# EasyEDA schematic SCHEasyEda.json
TITLE: Sheet_1; REV: 1.0; Date: 2024-06-20; Sheet: 1/1; Drawn By: paologgalang; Company: Your Company
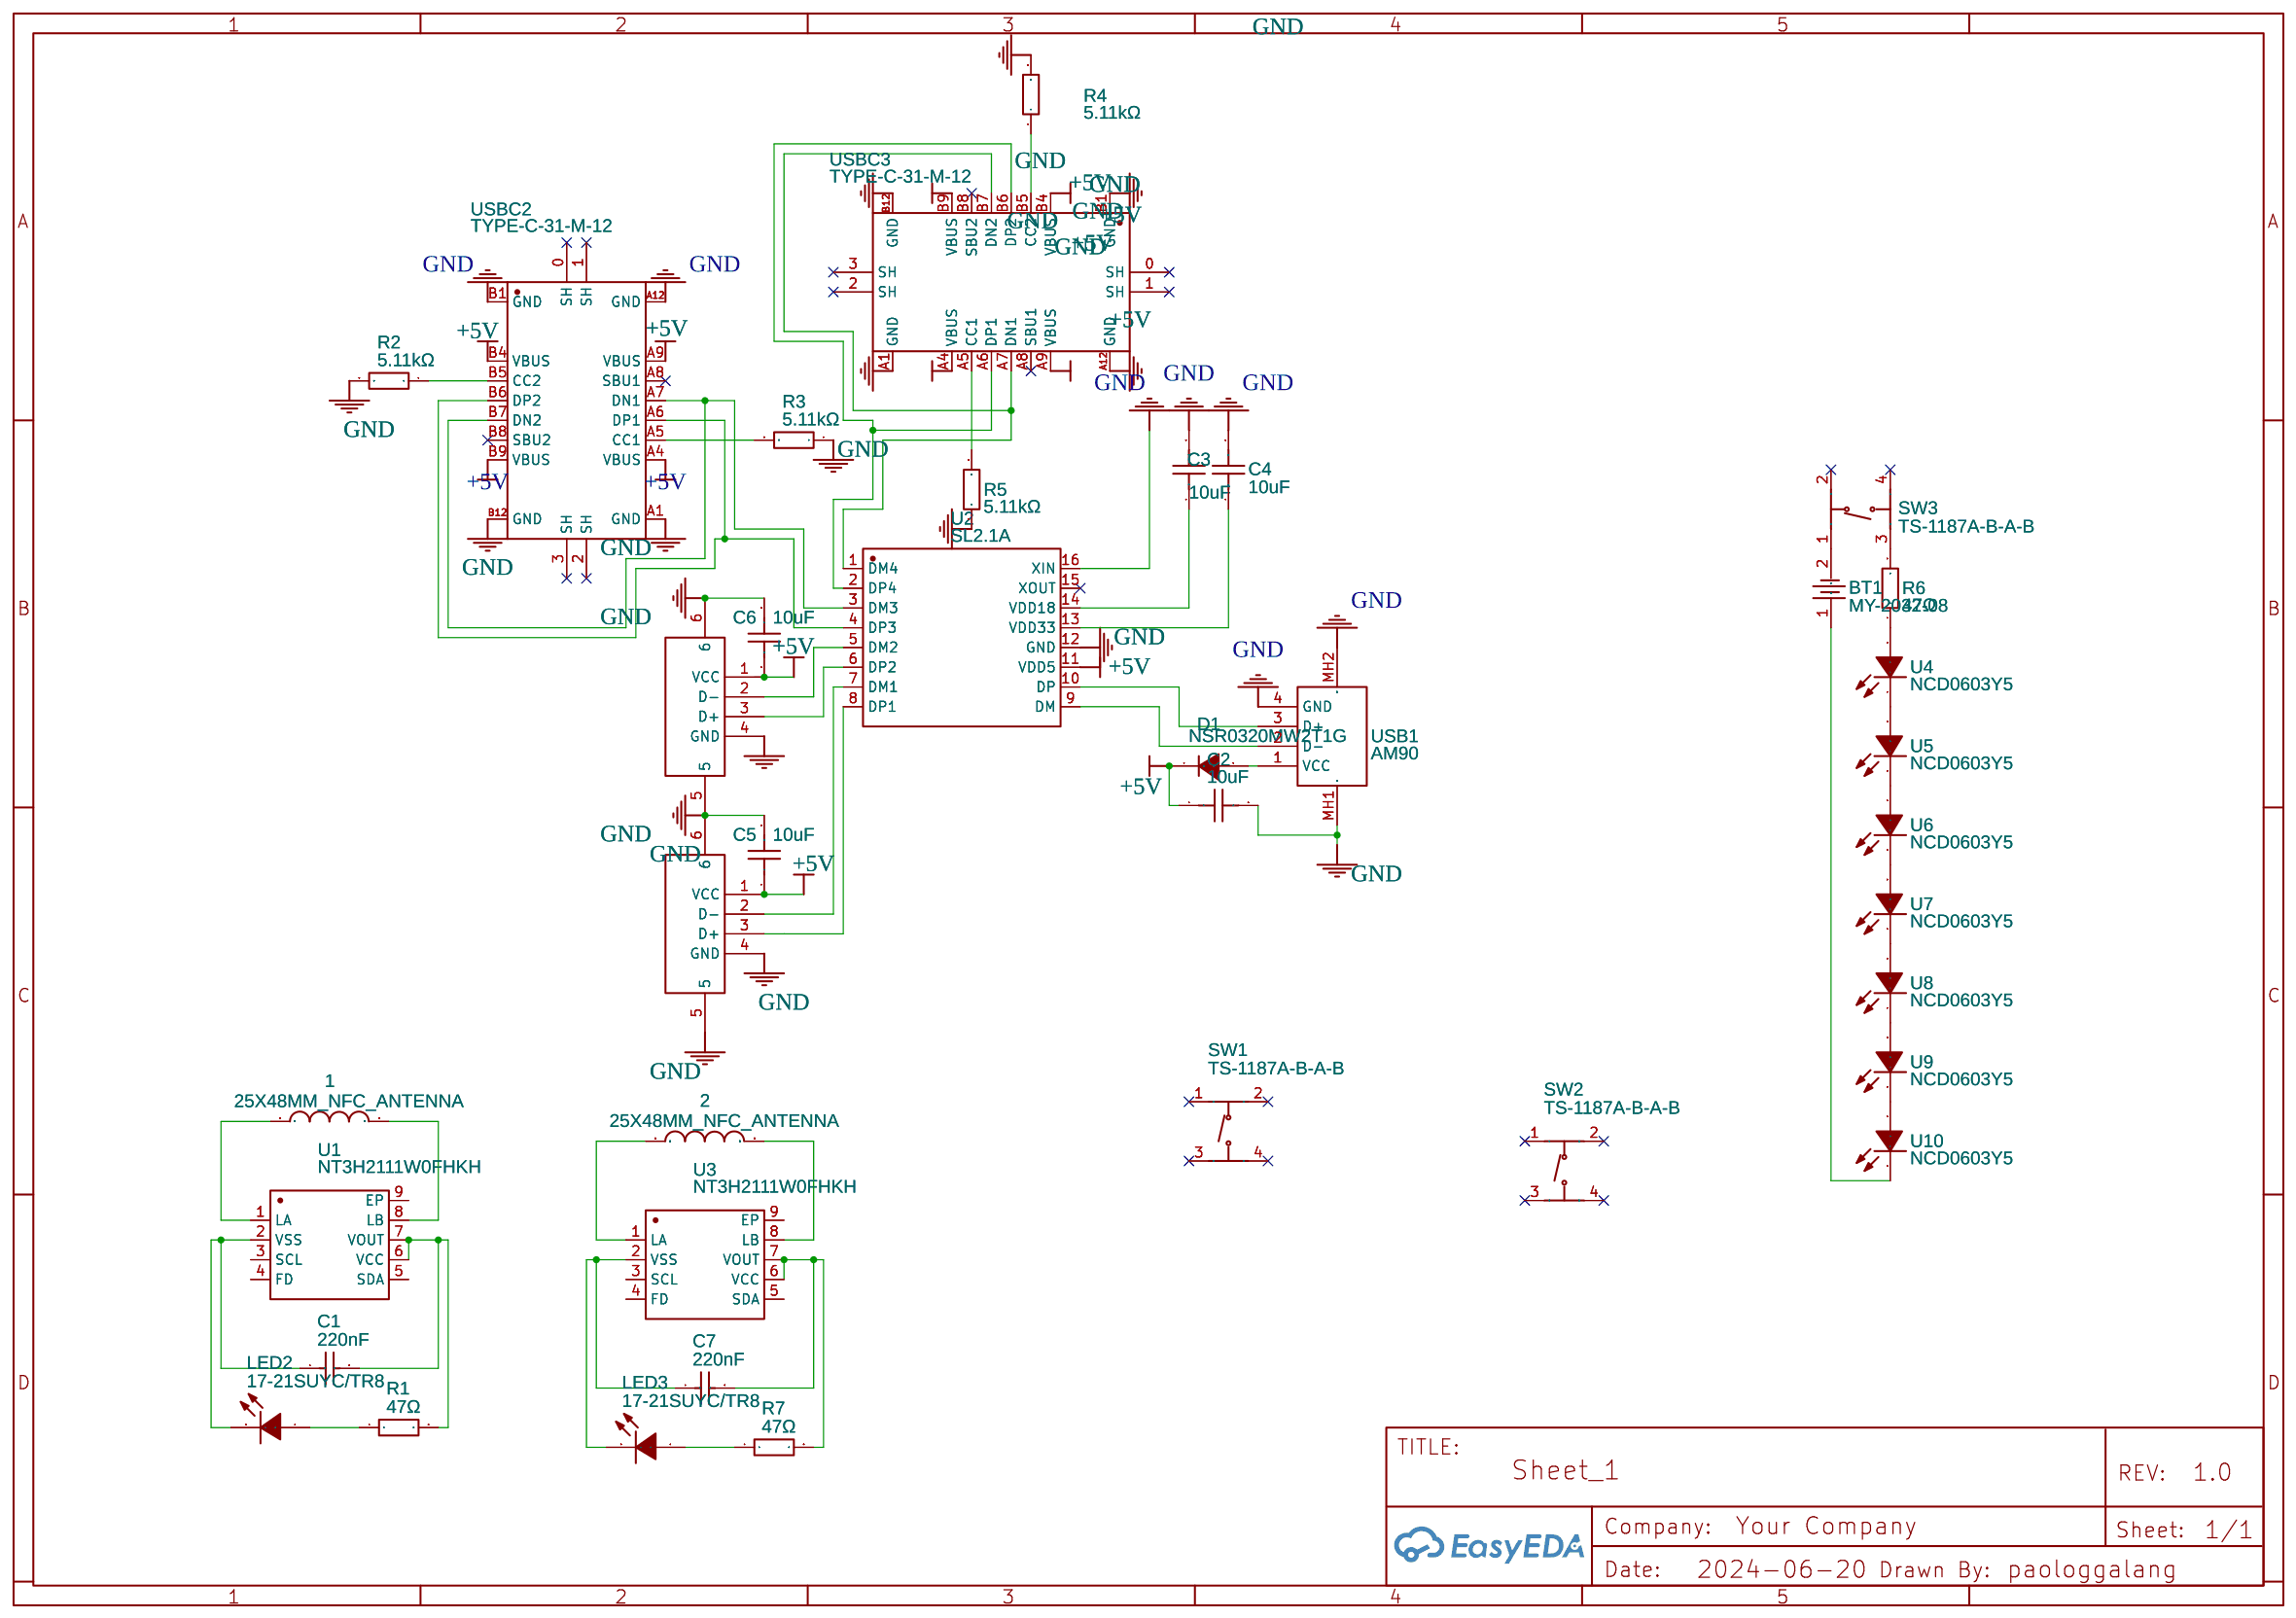
[diagram p0: schematic sheet]

## Parts
1  25X48MM_NFC_ANTENNA  [25X48MM_NFC_ANTENNA]
2  25X48MM_NFC_ANTENNA  [25X48MM_NFC_ANTENNA]
BT1  MY-2032-08  [BAT-SMD_MY-2032-08]
C1  220nF  [C0603]
C2  10uF  [C0603]
C3  10uF  [C0603]
C4  10uF  [C0603]
C5  10uF  [C0603]
C6  10uF  [C0603]
C7  220nF  [C0603]
D1  NSR0320MW2T1G  [SOD-323_L1.8-W1.3-LS2.5-RD]
LED2  17-21SUYC/TR8  [LED0805-R-RD]
LED3  17-21SUYC/TR8  [LED0805-R-RD]
R1  47Ω  [R0603]
R2  5.11kΩ  [R1206]
R3  5.11kΩ  [R1206]
R4  5.11kΩ  [R1206]
R5  5.11kΩ  [R1206]
R6  47Ω  [R0603]
R7  47Ω  [R0603]
SW1  TS-1187A-B-A-B  [SW-SMD_4P-L5.1-W5.1-P3.70-LS6.5-TL-2]
SW2  TS-1187A-B-A-B  [SW-SMD_4P-L5.1-W5.1-P3.70-LS6.5-TL-2]
SW3  TS-1187A-B-A-B  [SW-SMD_4P-L5.1-W5.1-P3.70-LS6.5-TL-2]
U1  NT3H2111W0FHKH  [XQFN-8_L1.6-W1.6-P0.50-BL]
U2  SL2.1A  [SOP-16_L10.0-W3.9-P1.27-LS6.0-BL]
U3  NT3H2111W0FHKH  [XQFN-8_L1.6-W1.6-P0.50-BL]
U4  NCD0603Y5  [LED0603-RD]
U5  NCD0603Y5  [LED0603-RD]
U6  NCD0603Y5  [LED0603-RD]
U7  NCD0603Y5  [LED0603-RD]
U8  NCD0603Y5  [LED0603-RD]
U9  NCD0603Y5  [LED0603-RD]
U10  NCD0603Y5  [LED0603-RD]
USB1  AM90  [USB-AM-TH_AM90]
USB2  USB-AF-90-14.4X13.6-H7.0-DIP  [USB-A-TH_C46407]
USB6  USB-AF-90-14.4X13.6-H7.0-DIP  [USB-A-TH_C46407]
USBC2  TYPE-C-31-M-12  [USB-C_SMD-TYPE-C-31-M-12]
USBC3  TYPE-C-31-M-12  [USB-C_SMD-TYPE-C-31-M-12]

## Library data of the parts
1 2 = 25X48MM_NFC_ANTENNA: Contributor: Спас Христов
BT1 = MY-2032-08: Contributor: LCSC; Supplier: LCSC; Supplier Part: C964831; Manufacturer: MYOUNG(美阳); JLCPCB Part Class: Extended Part
C1 C7 = CL10B224KA8NNNC: Supplier: LCSC; Manufacturer: SAMSUNG(三星); Supplier Part: C21120; JLCPCB Part Class: Basic Part
C2-C6 = CL10A106KP8NNNC: Supplier: LCSC; Manufacturer: SAMSUNG(三星); Supplier Part: C19702; JLCPCB Part Class: Basic Part
D1 = NSR0320MW2T1G: Supplier: LCSC; Manufacturer: onsemi(安森美); Supplier Part: C48192; JLCPCB Part Class: Extended Part
LED2 LED3 = 17-21SUYC/TR8: Supplier: LCSC; Manufacturer: KENTO; Manufacturer Part: KT-0805黄灯; Supplier Part: C2296; JLCPCB Part Class: Basic Part
R1 R6 R7 = 0603WAF470JT5E: Supplier: LCSC; Manufacturer: UNI-ROYAL(厚声); Supplier Part: C23182; JLCPCB Part Class: Basic Part
R2-R5 = RMC12065.11K1%N: Contributor: LCSC; Supplier: LCSC; Supplier Part: C269628; Manufacturer: Tyohm(幸亚电阻); JLCPCB Part Class: Extended Part
SW1-SW3 = TS-1187A-B-A-B: Contributor: LCSC; Supplier: LCSC; Supplier Part: C318884; Manufacturer: XKB Connectivity(中国星坤); JLCPCB Part Class: Basic Part
U1 U3 = NT3H2111W0FHKH: Contributor: LCSC; Supplier: LCSC; Supplier Part: C710403; Manufacturer: NXP(恩智浦); JLCPCB Part Class: Extended Part
U2 = SL2.1A: Contributor: LCSC; Supplier: LCSC; Supplier Part: C192893; Manufacturer: CoreChips(和芯润德); JLCPCB Part Class: Extended Part
U4-U10 = NCD0603Y5: Contributor: lcsc; Supplier: LCSC; Supplier Part: C7429912; Manufacturer: 国星光电; JLCPCB Part Class: Extended Part
USB1 = AM90: Contributor: LCSC; Supplier: LCSC; Supplier Part: C404965; Manufacturer: SHOU HAN(首韩); JLCPCB Part Class: Extended Part
USB2 USB6 = USB-AF-90-14.4X13.6-H7.0-DIP: Contributor: LCSC; Supplier: LCSC; Supplier Part: C46407; Manufacturer: 精拓金; Manufacturer Part: 903-131A1011D10100; JLCPCB Part Class: Extended Part
USBC2 USBC3 = TYPE-C-31-M-12: Contributor: LCSC; Supplier: LCSC; Supplier Part: C165948; Manufacturer: 韩国韩荣; JLCPCB Part Class: Extended Part

## Nets
+5V: C2.1 C5.1 C6.1 D1.1(C) U2.11(VDD5) USB2.1(VCC) USB6.1(VCC) USBC2.A4(VBUS) USBC2.A9(VBUS) USBC2.B4(VBUS) USBC2.B9(VBUS) USBC3.A4(VBUS) USBC3.A9(VBUS) USBC3.B4(VBUS) USBC3.B9(VBUS)
GND: C2.2 C3.2 C4.2 C5.2 C6.2 R2.2 R3.1 R4.2 R5.1 U2.12(GND) U2.16(XIN) USB1.4(GND) USB1.MH1 USB1.MH2 USB2.4(GND) USB2.5 USB2.6 USB6.4(GND) USB6.5 USB6.6 USBC2.A1(GND) USBC2.A12(GND) USBC2.B1(GND) USBC2.B12(GND) USBC3.A1(GND) USBC3.A12(GND) USBC3.B1(GND) USBC3.B12(GND)
Net-(1-P$1): 1.P$1 U1.1(LA)
Net-(1-P$2): 1.P$2 U1.8(LB)
Net-(2-P$1): 2.P$1 U3.1(LA)
Net-(2-P$2): 2.P$2 U3.8(LB)
Net-(BT1-1): BT1.1 U10.1(-)
Net-(BT1-2): BT1.2 SW3.1(A)
Net-(C1-1): C1.1 LED2.2(-) U1.2(VSS)
Net-(C1-2): C1.2 R1.2 U1.6(VCC) U1.7(VOUT)
Net-(C3-1): C3.1 U2.14(VDD18)
Net-(C4-1): C4.1 U2.13(VDD33)
Net-(C7-1): C7.1 LED3.2(-) U3.2(VSS)
Net-(C7-2): C7.2 R7.2 U3.6(VCC) U3.7(VOUT)
Net-(D1-2): D1.2(A) USB1.1(VCC)
Net-(LED2-1): LED2.1(+) R1.1
Net-(LED3-1): LED3.1(+) R7.1
Net-(R2-1): R2.1 USBC2.B5(CC2)
Net-(R3-2): R3.2 USBC2.A5(CC1)
Net-(R4-1): R4.1 USBC3.B5(CC2)
Net-(R5-2): R5.2 USBC3.A5(CC1)
Net-(R6-1): R6.1 U4.2(+)
Net-(R6-2): R6.2 SW3.3(C)
Net-(U2-1): U2.1(DM4) USBC3.A7(DN1) USBC3.B7(DN2)
Net-(U2-2): U2.2(DP4) USBC3.A6(DP1) USBC3.B6(DP2)
Net-(U2-3): U2.3(DM3) USBC2.A7(DN1) USBC2.B7(DN2)
Net-(U2-4): U2.4(DP3) USBC2.A6(DP1) USBC2.B6(DP2)
Net-(U2-5): U2.5(DM2) USB2.2(D-)
Net-(U2-6): U2.6(DP2) USB2.3(D+)
Net-(U2-7): U2.7(DM1) USB6.2(D-)
Net-(U2-8): U2.8(DP1) USB6.3(D+)
Net-(U2-9): U2.9(DM) USB1.2(D-)
Net-(U2-10): U2.10(DP) USB1.3(D+)
Net-(U4-1): U4.1(-) U5.2(+)
Net-(U5-1): U5.1(-) U6.2(+)
Net-(U6-1): U6.1(-) U7.2(+)
Net-(U7-1): U7.1(-) U8.2(+)
Net-(U8-1): U8.1(-) U9.2(+)
Net-(U9-1): U9.1(-) U10.2(+)

Not connected (* = marked no-connect by the designer): SW1 1(A)* 2(B)* 3(C)* 4(D)*; SW2 1(A)* 2(B)* 3(C)* 4(D)*; SW3 2(B)* 4(D)*; U1 3(SCL) 4(FD) 5(SDA) 9(EP); U2 15(XOUT)*; U3 3(SCL) 4(FD) 5(SDA) 9(EP); USBC2 0(SH)* 1(SH)* 2(SH)* 3(SH)* A8(SBU1)* B8(SBU2)*; USBC3 0(SH)* 1(SH)* 2(SH)* 3(SH)* A8(SBU1)* B8(SBU2)*
